# EAGLE design emonBike v0.1 (EAGLE 7.7.0)
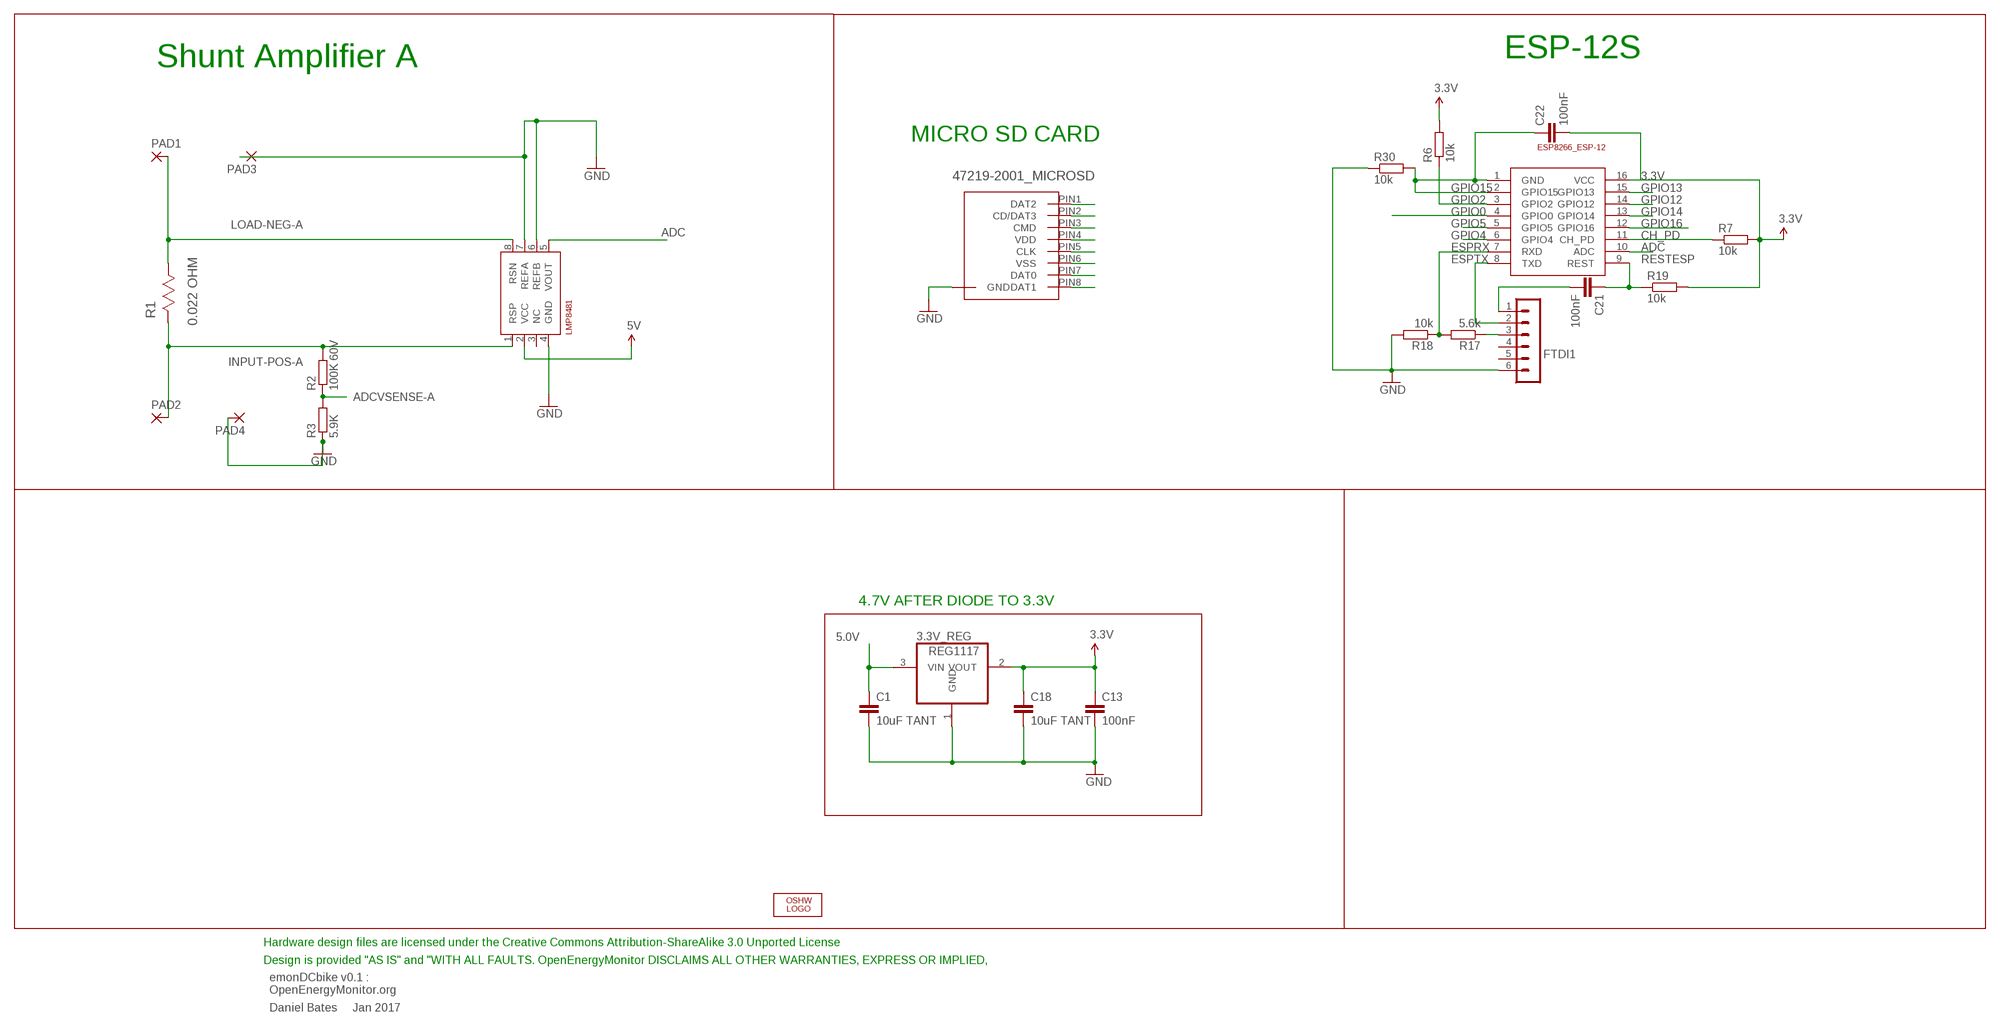
[diagram p0: schematic, sheet 1]

## Parts
3.3V_REG  REG1117  [SOT223]
C1  10uF TANT  C-EUC0603  [C0603]
C13  100nF  C-EUC0603  [C0603]
C18  10uF TANT  C-EUC0603  [C0603]
C21  100nF  C-EUC0603  [C0603]
C22  100nF  C-EUC0603  [C0603]
ESP-12  ESP8266_ESP-12  [ESP8266-ESP12]
FTDI1  FTDI-ESP  MA06-1  [MA06-1]
LOGO1  OSHW_LOGO_6MILX0200-NT  [OSHW_6X200_NOTEXT]
PAD1  3,81/1,4  [3,81/1,4]
PAD2  3,81/1,4  [3,81/1,4]
PAD3  3,81/1,4  [3,81/1,4]
PAD4  3,81/1,4  [3,81/1,4]
R1  0.022 OHM  ERJ-8CWFR022V  [RESC3216X71N]
R2  100K 60V  R-EU_R0603  [R0603]
R3  5.9K  R-EU_R0603  [R0603]
R6  10k  R-EU_R0603  [R0603]
R7  10k  R-EU_R0603  [R0603]
R17  5.6k  R-EU_R0603  [R0603]
R18  10k  R-EU_R0603  [R0603]
R19  10k  R-EU_R0603  [R0603]
R30  10k  R-EU_R0603  [R0603]
SHUNTMON-A  LMP8481  LMP8481LMP8481-H  [S-PDSO-G08]
U$1  47219-2001_MICROSD  [47219-2001_MICROSD]

## Nets
3.3V: 3.3V_REG.2(VOUT) C13.1 C18.1 C22.2 ESP-12.16(VCC) R6.2 R7.2 R19.2 U$1.PIN4(VDD)
4.7V [power]: SHUNTMON-A.2(VCC) ; supply symbol labelled 5V
5.0V [power]: 3.3V_REG.3(VIN) C1.1
ADC: ESP-12.10(ADC) SHUNTMON-A.5(VOUT)
ADCVSENSE-A: R2.1 R3.2
CH_PD: ESP-12.11(CH_PD) R7.1
ESPRX: ESP-12.7(RXD) R17.2 R18.1
ESPTX: ESP-12.8(TXD) FTDI1.2
GND [thin_power]: 3.3V_REG.1(GND) C1.2 C13.2 C18.2 FTDI1.6 PAD3.1(P) PAD4.1(P) R3.1 R18.2 R30.1 SHUNTMON-A.4(GND) SHUNTMON-A.6(REFB) SHUNTMON-A.7(REFA) U$1.P$1(GND) U$1.P$2(GND) U$1.P$3(GND) U$1.P$4(GND) U$1.PIN6(VSS)
GPIO0: ESP-12.4(GPIO0)
GPIO2: ESP-12.3(GPIO2) R6.1 U$1.PIN2(CD/DAT3)
GPIO4: ESP-12.6(GPIO4)
GPIO5: ESP-12.5(GPIO5)
GPIO12: ESP-12.14(GPIO12) U$1.PIN7(DAT0)
GPIO13: ESP-12.15(GPIO13) U$1.PIN3(CMD)
GPIO14: ESP-12.13(GPIO14) U$1.PIN5(CLK)
GPIO15: C22.1 ESP-12.1(GND) ESP-12.2(GPIO15) R30.2
GPIO16: ESP-12.12(GPIO16)
INPUT-POS-A: PAD2.1(P) R1.2(R2) R2.2 SHUNTMON-A.1(RSP)
LOAD-NEG-A: PAD1.1(P) R1.1(R1) SHUNTMON-A.8(RSN)
N$7: U$1.PIN1(DAT2)
N$30: C21.2 FTDI1.1
N$32: U$1.PIN8(DAT1)
N$36: FTDI1.3 R17.1
RESTESP: C21.1 ESP-12.9(REST) R19.1
Unconnected: FTDI1.4 FTDI1.5 SHUNTMON-A.3(NC)

## Notes on the sheet
- Shunt Amplifier A | ESP-12S
- MICRO SD CARD
- 4.7V AFTER DIODE TO 3.3V
- Hardware design files are licensed under the Creative Commons Attribution-ShareAlike 3.0 Unported License
- Design is provided "AS IS" and "WITH ALL FAULTS. OpenEnergyMonitor DISCLAIMS ALL OTHER WARRANTIES, EXPRESS OR IMPLIED,
- emonDCbike v0.1 :
  OpenEnergyMonitor.org
- Daniel Bates     Jan 2017

## Library data of the parts
3.3V_REG = burr-brown:REG1117: 800mA and 1A Low Dropout (LDO) Positive Regulator 1.8V, 2.5V, 2.85V, 3.3V, 5V, and Adj; MF: TEXAS INSTRUMENTS; MPN: REG1117; OC_FARNELL: 1097566; OC_NEWARK: 14P6981
C1 C13 C18 C21 C22 = rcl:C-EU: CAPACITOR, European symbol
ESP-12 = ESP8266-ESP12:ESP8266_ESP-12
FTDI1 = JeeLabs:MA06-1: PIN HEADER
LOGO1 = ohw-logo:OSHW_LOGO_6MIL; OC_FARNELL: unknown
PAD1-PAD4 = wirepad:3,81/1,4: THROUGH-HOLE PAD
R1 = Panasonic-ERJ3_ERJ8_ERJA_ERJB:ERJ-8C: Thick Film Chip Resistors/Low Resistance Type ,1206, 0.5W, ±1 %; MPN: ERJ-8CWFR022V; OC_FARNELL: 2145292; OC_NEWARK: 28W1688; PACKAGE: 1206; POWERRATING: 1W; SUPPLIER: PANASONIC; TOLERANCE: ± 1 %
R2 = rcl:R-EU_: RESISTOR, European symbol; MPN: MCWR06X1003FTL
R3 = rcl:R-EU_: RESISTOR, European symbol; MPN: MCWR06X5901FTL
R6 R7 R17-R19 R30 = rcl:R-EU_: RESISTOR, European symbol
SHUNTMON-A = lmp8481b:LMP8481: LMP8481MM-H/NOPB 100V/V; MF: TEXAS INSTRUMENTS; MPN: LMP8481MME-S/NOPB; OC_FARNELL: 2322044
U$1 = 47219-2001_SD_MICRO:47219-2001_MICROSD

## Net classes
2 thin_power: width 0.254 mm

## Board
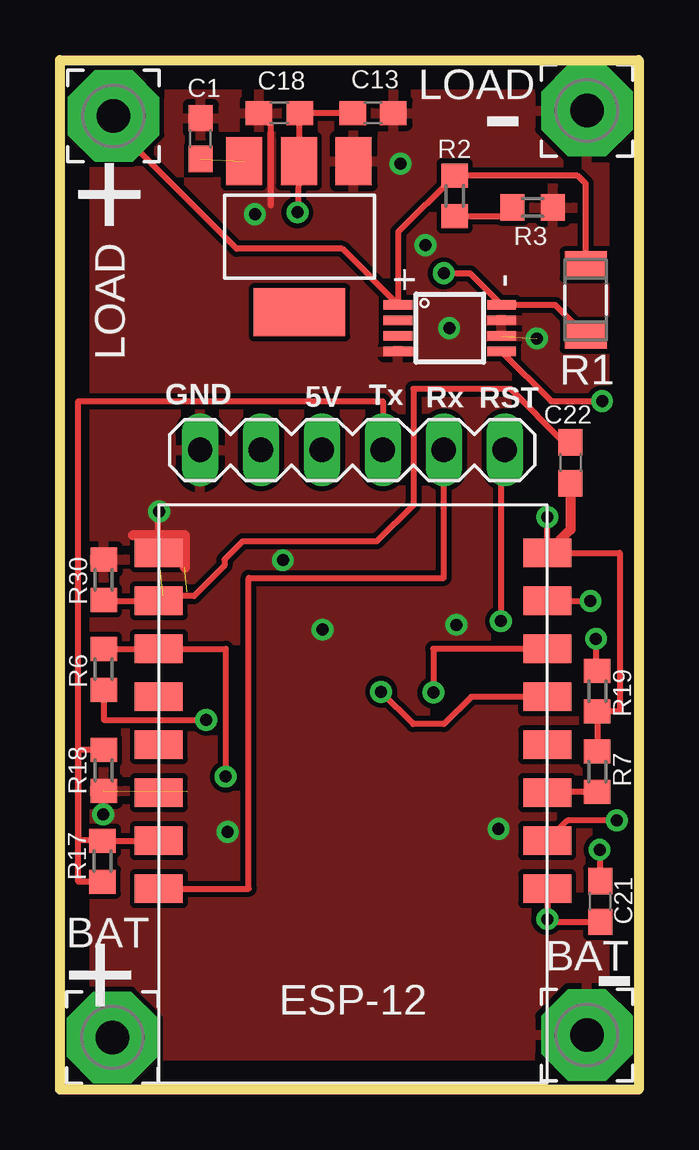
[diagram p1: board, top side]
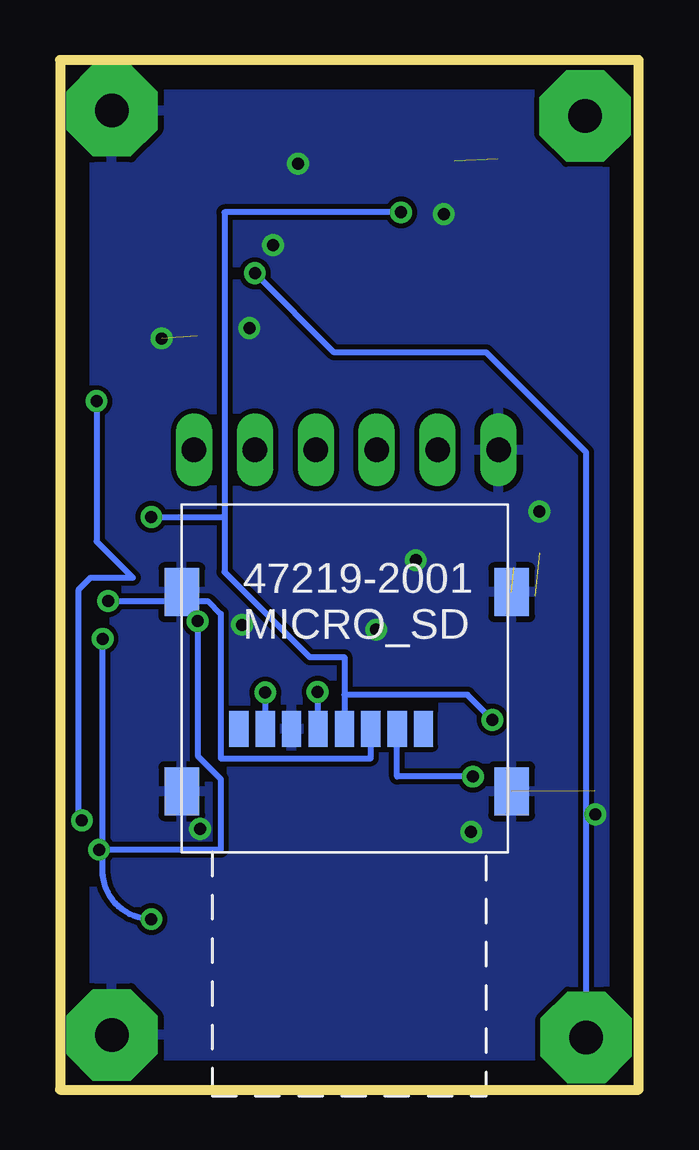
[diagram p2: board, bottom side, seen from below]

Size 24.13 x 42.93 mm. Coordinates in mm from the lower left corner, seen from the top.
Outline: 0,42.93 24.13,42.93 24.13,0 0,0 0,42.93
Copper layers (1*16): Top 0.035mm / dielectric 1.5mm / Bottom 0.035mm
Design rules "default": minimum track width 10mil, minimum drill 24mil, track to track 8mil, track to pad 8mil, pad to pad 8mil, via to via 8mil, smd to smd 8mil, copper to edge 40mil, drill to drill 8mil, minimum pad ring 10mil, minimum via ring 8mil, stop-mask expansion 4mil, vias tented up to drill 0mil, thermal gap 10mil

### Footprints (pad centres in the part's own frame; a part is rotated, then mirrored left to right if it is on the bottom)
SOT223 = smd 1.499 x 2.007: 1 -2.261,-3.15; 2 0.025,-3.15; 3 2.311,-3.15 | smd 3.81 x 2.007: 4 0,3.15
C0603 = smd 1.1 x 1: 1 -0.85,0; 2 0.85,0
ESP8266-ESP12 = smd 2 x 1.2: 1 16.2,2; 2 16.2,4; 3 16.2,6; 4 16.2,8; 5 16.2,10; 6 16.2,12; 7 16.2,14; 8 16.2,16; 9 0,16; 10 0,14; 11 0,12; 12 0,10; 13 0,8; 14 0,6; 15 0,4; 16 0,2
MA06-1 = drill 1.016 long: 1 0,0; 2 2.54,0; 3 5.08,0; 4 7.62,0; 5 10.16,0; 6 12.7,0
3,81/1,4 = drill 1.397 pad 3.81 octagon: 1 0,0
RESC3216X71N = smd 1.118 x 1.753: 1 -1.473,0; 2 1.473,0
R0603 = smd 1 x 1.1: 1 -0.85,0; 2 0.85,0
S-PDSO-G08 = smd 0.4 x 1.2: 1 -0.975,-2.157; 2 -0.325,-2.157; 3 0.325,-2.157; 4 0.975,-2.157; 5 0.975,2.157; 6 0.325,2.157; 7 -0.325,2.157; 8 -0.975,2.157
47219-2001_MICROSD = smd 1.45 x 2: P$1 0,0; P$2 13.75,0; P$3 0,8.3; P$4 13.75,8.3 | smd 0.8 x 1.5: PIN1 10.08,2.6; PIN2 8.98,2.6; PIN3 7.88,2.6; PIN4 6.78,2.6; PIN5 5.68,2.6; PIN6 4.58,2.6; PIN7 3.48,2.6; PIN8 2.38,2.6

### Placement (x,y rotation side)
3.3V_REG  9.99,35.56 180 top
C1  5.87,39.65 90 top
C13  13.05,40.71 0 top
C18  9.14,40.72 180 top
C21  22.53,7.85 90 top
C22  21.29,26.14 270 top
ESP-12  20.32,24.38 180 top
FTDI1  18.54,26.67 180 top
LOGO1  -18.83,11.35 0 bottom  (outside the outline)
PAD1  2.18,2.18 0 top
PAD2  2.24,40.59 0 top
PAD3  21.97,2.29 0 top
PAD4  21.97,40.82 0 top
R1  21.92,32.92 90 top
R2  16.46,37.26 90 top
R3  19.71,36.78 180 top
R6  1.83,17.53 270 top
R7  22.4,13.26 90 top
R17  1.78,9.53 90 top
R18  1.83,13.31 270 top
R19  22.4,16.61 270 top
R30  1.83,21.26 270 top
SHUNTMON-A  16.26,31.75 270 top
U$1  19.05,12.45 0 bottom

### Tracks (layer width: path | path; a pad name or v marks a point on that pad's centre or on a via)
3.3V  (via drill 0.5)
  Top 0.254: R6.2 1.83,15.42 v6.1,15.42 | R7.2 R19.2 23.34,15.77 23.34,22.38 ESP-12.16 v20.32,23.88 | C13.1 C18.1 9.96,40.72 3.3V_REG.2 v9.91,36.58
  Top 0.406: C22.2 21.29,23.35 ESP-12.16
  Bottom 0.254: v6.1,15.42 7.14,16.46 12.27,16.46 | 12.27,16.46 U$1.PIN4 | v20.32,23.88 17.27,23.88 | 17.27,23.88 17.27,21.59 13.72,18.03 12.27,18.03 12.27,16.46 | v9.91,36.58 17.27,36.58 17.27,23.88
5.0V  (1 unrouted)
ADC  (via drill 0.5)
  Top 0.254: SHUNTMON-A.5 20.49,28.7 v22.61,28.7 | v23.22,11.23 21.16,11.23 ESP-12.10
  Bottom 0.254: v22.61,28.7 22.61,22.86 21.08,21.34 22.86,21.34 23.37,20.83 23.37,11.38 v23.22,11.23
ADCVSENSE-A
  Top 0.254: R2.1 18.49,36.41 R3.2
CH_PD
  Top 0.254: R7.1 20.32,12.41 ESP-12.11
ESPRX
  Top 0.254: ESP-12.7 arc-90 ESP-12.7 R17.2 1.78,10.41 0.76,10.41 0.76,14.16 R18.1
ESPTX
  Top 0.254: ESP-12.8 7.87,8.38 7.87,21.34 16,21.34 FTDI1.2
GND  (via drill 0.5)  (3 unrouted)
  Top 0.254: 4.06,24.13 4.06,22.35 | C18.2 8.79,40.22 8.79,36.85
  Top 0.406: 3.05,23.11 5.21,23.11 5.21,21.77
  other vias: 1.8,11.48 16.54,19.38 18.29,10.87 16.23,31.75 14.2,38.61 8.13,36.5 15.24,35.2 10.95,19.18 4.14,24.1 19.89,31.32 9.3,22.07 6.99,10.74
  pour Top: 0.25,42.67 23.88,42.67 23.88,0.25 0.25,0.25
  pour Bottom: 0.25,42.67 23.88,42.67 23.88,0.25 0.25,0.25
GPIO2  (via drill 0.5)
  Top 0.254: R6.1 ESP-12.3 6.91,18.38 v6.91,13.06
  Bottom 0.254: v6.91,13.06 10.07,13.06 U$1.PIN2
GPIO12  (via drill 0.5)
  Top 0.254: ESP-12.14 15.57,18.38 v15.57,16.56
  Bottom 0.254: v15.57,16.56 | v15.57,16.56 U$1.PIN7
GPIO13  (via drill 0.5)
  Top 0.254: ESP-12.15 v22.12,20.38 v22.12,20.37
  Bottom 0.254: U$1.PIN3 11.17,13.82 17.42,13.82 17.42,19.84 17.96,20.37 v22.12,20.37
GPIO14  (via drill 0.5)
  Top 0.254: ESP-12.13 17.15,16.38 16,15.24 14.73,15.24 v13.39,16.59
  Bottom 0.254: v13.39,16.59 13.39,15.06 U$1.PIN5
GPIO15  (1 unrouted)
  Top 0.254: R30.2 1.86,20.38 ESP-12.2 4.31,20.57 5.59,20.57 6.86,21.84 6.86,22.1 7.62,22.86 13.21,22.86 14.73,24.38 14.73,29.21 18.8,29.21 21.02,26.99 C22.1
INPUT-POS-A
  Top 0.254: R1.2 21.92,37.77 21.59,38.1 16.47,38.1 R2.2 14.1,35.75 SHUNTMON-A.1 11.77,35.05 7.37,35.05 2.24,40.18 PAD2.1
LOAD-NEG-A  (via drill 0.5)
  Top 0.254: v16,34.04 17.1,34.04 SHUNTMON-A.8 20.64,32.73 R1.1
  Bottom 0.254: PAD1.1 2.18,26.57 6.35,30.73 12.7,30.73 v16,34.04
N$30  (via drill 0.5)
  Top 0.254: FTDI1.1 18.39,26.67 v18.39,19.53 | v22.5,10.01 22.5,8.7 C21.2
  Bottom 0.254: v18.39,19.53 18.39,13.92 17.42,12.95 17.42,10.01 v22.5,10.01
N$36
  Top 0.254: R17.1 0.76,8.68 0.76,28.7 13.46,28.7 FTDI1.3
RESTESP  (via drill 0.5)
  Top 0.254: C21.1 20.32,7 v20.32,7.11 ESP-12.9 | v22.35,18.8 22.35,17.51 arc90 R19.1
  Bottom 0.254: v20.32,7.11 arc90 22.35,9.14 v22.35,18.8

### Text on the board
bPlace: Designed in | North Wales | Made in UK | Lead free PCB - RoHS components | Open-Hardware
tNames: LOAD | - | + | LOAD | BAT | BAT | + | -
tSilk: GND | 5V | Tx | Rx | RST | emonDC | Wireless Energy / Monitoring Node | v0.4 Jan 2017 by DB
_tsilk: Designed in | North Wales | Made in UK
_bsilk: SMT V0.6 rev3 | emonTx | wireless energy monitoring node | SMT V0.6 rev3 | emonTx | SMT V0.6 rev3 | emonTx | Technology that helps us live within ecological limits | wireless energy monitoring node | wireless energy monitoring node | Designed in North Wales UK by Glyn Hudson & Trystan Lea | Technology that helps us live within ecological limits | Technology that helps us live within ecological limits | Designed in North Wales UK by Glyn Hudson & Trystan Lea | 165mm ant | 433Mhz | Designed in North Wales UK by Glyn Hudson & Trystan Lea | 165mm ant | 165mm ant | 433Mhz | 433Mhz | 868Mhz | 82mm ant | 82mm ant | 82mm ant | 868Mhz | 868Mhz | 78mm ant | 915Mhz | 78mm ant | 915Mhz | 78mm ant | 915Mhz | 165mm ant | 433Mhz | 82mm ant | 868Mhz | 78mm ant | 915Mhz